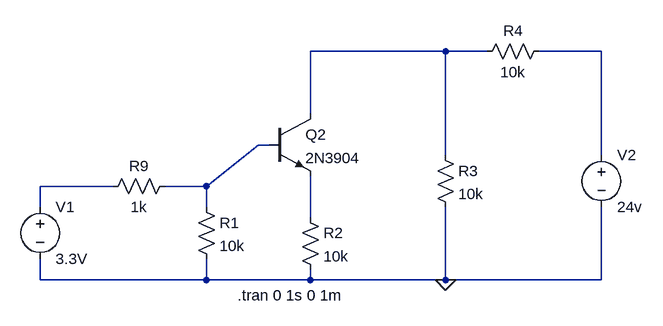
[diagram p0: schematic Prob 5_AFTER DJM.asc]
Prob 5_AFTER DJM.asc, the LTspice schematic file:
Version 4
SHEET 1 1096 680
WIRE 176 80 -32 80
WIRE 240 80 176 80
WIRE 416 80 320 80
WIRE -32 176 -32 80
WIRE -96 224 -112 224
WIRE 176 240 176 80
WIRE 416 240 416 80
WIRE -336 288 -448 288
WIRE -192 288 -112 224
WIRE -192 288 -256 288
WIRE -448 320 -448 288
WIRE -192 320 -192 288
WIRE -32 336 -32 272
WIRE -448 432 -448 400
WIRE -192 432 -192 400
WIRE -192 432 -448 432
WIRE -32 432 -32 416
WIRE -32 432 -192 432
WIRE 176 432 176 320
WIRE 176 432 -32 432
WIRE 416 432 416 320
WIRE 416 432 176 432
FLAG 176 432 0
SYMBOL res -48 320 R0
SYMATTR InstName R2
SYMATTR Value 10k
SYMBOL voltage -448 304 R0
WINDOW 123 0 0 Left 0
WINDOW 39 0 0 Left 0
SYMATTR InstName V1
SYMATTR Value 3.3V
SYMBOL voltage 416 224 R0
WINDOW 123 0 0 Left 0
WINDOW 39 0 0 Left 0
SYMATTR InstName V2
SYMATTR Value 24v
SYMBOL npn -96 176 R0
SYMATTR InstName Q2
SYMATTR Value 2N3904
SYMBOL res -208 304 R0
SYMATTR InstName R1
SYMATTR Value 10k
SYMBOL res -240 272 R90
WINDOW 0 0 56 VBottom 2
WINDOW 3 32 56 VTop 2
SYMATTR InstName R9
SYMATTR Value 1k
SYMBOL res 160 224 R0
SYMATTR InstName R3
SYMATTR Value 10k
SYMBOL res 336 64 R90
WINDOW 0 0 56 VBottom 2
WINDOW 3 32 56 VTop 2
SYMATTR InstName R4
SYMATTR Value 10k
TEXT -144 456 Left 2 !.tran 0 1s 0 1m

The netlist it stands for:
* Prob 5_AFTER DJM.asc
R2 N005 0 10k
V1 N004 0 3.3V
V2 N002 0 24v
Q2 N001 N003 N005 0 2N3904
R1 N003 0 10k
R9 N003 N004 1k
R3 N001 0 10k
R4 N002 N001 10k
.model NPN NPN
.model PNP PNP
.lib standard.bjt
.tran 0 1s 0 1m
.backanno
.end